# Altium schematic sheet B303AA.SchDoc: Manuel Shot Button
size A4; SheetNumber: 1; SheetTotal: 1
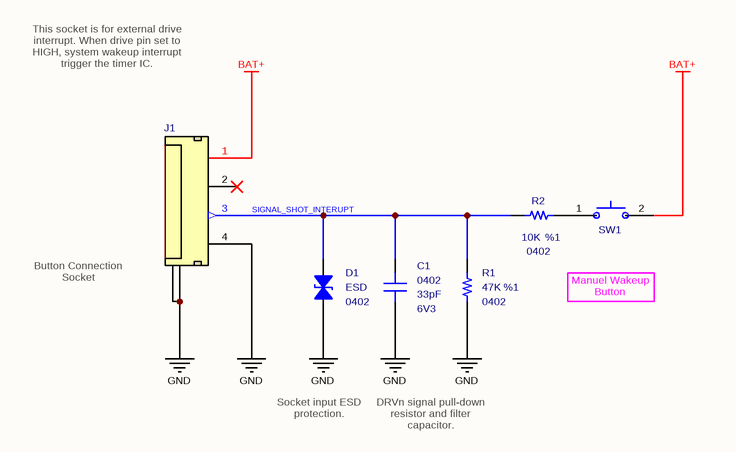
[diagram p0: B303AA.SchDoc]

## Parts
C1  value 33pF  Case: 0402  Voltage: 6V3  [CAPACITOR_0402]  (hidden comment: Multilayer Ceramic Capacitor)
D1  Case: 0402  [ESD_0402]  (hidden comment: ESD Suppressors)
J1  Shot Button Socket  [Connector_Tunic 4P - H]  (value not drawn)
R1  value 47K  Tolerance: %1  Case: 0402  [RESISTOR_0402]  (hidden comment: Thick Film Resistor)
R2  value 10K  Tolerance: %1  Case: 0402  [RESISTOR_0402]  (hidden comment: Thick Film Resistor)
SW1  Tactile Switches  [PTS526_Switch]  (value not drawn)

## Nets
BAT+: J1.1(BAT+) SW1.2(COM)
GND: C1.1 D1.1 J1.4(GND) J1.5(Termination) J1.6(Termination) R1.1
SIGNAL_SHOT_INTERUPT: C1.2 D1.2 J1.3(Button) R1.2 R2.2
NetR2_1: R2.1 SW1.1(NC)

Not connected (* = marked no-connect by the designer): J1 2(NC)*

## Notes on the sheet
- This socket is for external drive interrupt. When drive pin set to HIGH, system wakeup interrupt trigger the timer IC.
- (near J1) Button Connection
  Socket
- Manuel Wakeup Button
- Socket input ESD protection.
- DRVn signal pull-down resistor and filter capacitor.
- Title
- Size:
- Date:
- A4
- Number:
- Time:
- Revision:
- Sheet
- of
- File:
- (in symbol Diode - ESD Protection) ESD

## Library data of the parts
C1 = Capacitor - 33pF [0402-6V3]: Capacitor - 33pF [0402] (Ceramic); Manufacturer_Name: Kemet; Manufacturer_Part_Number: C0402C330J9RACAUTO; Dielectric: X7R; Tolerance: 10%; Height: 0.5mm; Mouser_Part_Number: 80-C0402C330J9RAUTO; Maximum Operating Temperature: +125; Minimum Operating Temperature: -55; ROHS: Yes; ComponentLink1Description: DataSheet; ComponentLink1URL: https://api.kemet.com/component-edge/download/datasheet/C0402C330J9RACAUTO.pdf; ComponentLink2Description: Mouser; ComponentLink2URL: https://www.mouser.com/Search/Refine.aspx?Keyword=80-C0402C330J9RAUTO; Supplier 1: Mouser; Supplier Part Number 1: 80-C0402C330J9RAUTO
D1 = Diode - ESD Protection: TVS Diode (Bi-directional); Manufacturer_Name: Bussmann / Eaton; Manufacturer_Part_Number: 0402ESDA-MLP1; Clamping Voltage: 35V; Diode Capacitance: 0.05pF; Polarity: Bidirectional; Voltage ESD Air Gap: 15kV; Voltage ESD Contact: 8kV; Working Voltage: 30V; Height: 0.436mm; Mouser_Part_Number: 504-0402ESDA-MLP1; Maximum Operating Temperature: +125; Minimum Operating Temperature: -55; ROHS: Yes; ComponentLink1Description: DataSheet; ComponentLink1URL: https://www.mouser.com.tr/datasheet/2/87/47c59e11-d058-4882-bc35-d8572f2ca054-38826.pdf; ComponentLink2Description: Mouser; ComponentLink2URL: https://www.mouser.com.tr/ProductDetail/Bussmann-Eaton/0402ESDA-MLP1?qs=%2Fha2pyFadughxyc7TyLWeW%2FUvipVY6Ex3naV%2FjpO3plZBZWDLqV4bw%3D%3D; Supplier 1: Mouser; Supplier 2: Digi-Key; Supplier Part Number 2: 283-2964-1-ND; Supplier Part Number 1: 504-0402ESDA-MLP1
J1 = Connector - Mini Tunic 4P (1.25): Mini Tunic Connector with 4P; Manufacturer_Part_Number: 53261-0471; Manufacturer_Name: Molex; Pitch: 1.25mm; Position: 4; ROHS: Yes; ComponentLink1Description: DataSheet; ComponentLink1URL: https://www.mouser.com.tr/datasheet/2/276/0532610471_PCB_HEADERS-170942.pdf; ComponentLink2Description: Mouser; ComponentLink2URL: https://www.mouser.com.tr/ProductDetail/Molex/53261-0471?qs=%2Fha2pyFaduhLhIsk8tywtK7BwWtguBSP4XxyDBTOTfs%3D; Case: SMD; Mouser_Part_Number: 538-53261-0471; Supplier 1: Mouser; Supplier 2: Digi-Key; Supplier Part Number 1: 538-53261-0471; Supplier Part Number 2: WM7622CT-ND; System: Connector
R1 = Resistor - 47K: Thick Film Resistors - SMD 1/16 W 47 Kohms 1%; Manufacturer_Name: Vishay; Manufacturer_Part_Number: CRCW040247K0FKED; Height: 0.4mm; Mouser_Part_Number: 71-CRCW0402-47K-E3; ComponentLink1Description: DataSheet; ComponentLink1URL: https://www.mouser.com.tr/datasheet/2/427/dcrcwe3-1762152.pdf; ComponentLink2Description: Mouser; ComponentLink2URL: https://www.mouser.com.tr/ProductDetail/Vishay-Dale/CRCW040247K0FKED?qs=sGAEpiMZZMu61qfTUdNhG2DpbjADlD3GL%252B3h1elTxqU%3D; Supplier 1: Mouser; Supplier 2: Digi-Key; Supplier Part Number 1: 71-CRCW040247K0FKEDH; Supplier Part Number 2: 541-47.0KYCT-ND
R2 = Resistor - 10K: Thick Film Resistors - SMD 1/16 W 10 Kohms 1%; Manufacturer_Name: Vishay; Manufacturer_Part_Number: CRCW040210K0FKED; Height: 0.4mm; Mouser_Part_Number: 71-CRCW0402-10K-E3; ComponentLink1Description: DataSheet; ComponentLink1URL: https://www.mouser.com.tr/datasheet/2/427/dcrcwe3-1762152.pdf; ComponentLink2Description: Mouser; ComponentLink2URL: https://www.mouser.com.tr/ProductDetail/Vishay-Dale/CRCW040210K0FKED?qs=sGAEpiMZZMu61qfTUdNhG2DpbjADlD3GcalbOv9utCY%3D; Supplier 1: Mouser; Supplier 2: Digi-Key; Supplier Part Number 1: 71-CRCW040210K0FKEDH; Supplier Part Number 2: 541-10.0KYCT-ND
SW1 = Switch - Tactile (SMD): Tactile Switches 50mA 12VDC, 5.2x5.2mm, 0.8mm H, 260gf, G leads.; Manufacturer_Name: C&K Switches; Manufacturer_Part_Number: PTS526 SK08 SMTR2 LFS; Height: 0.8mm; Mouser_Part_Number: 611-PTS526SK08SMTR2L; ComponentLink1Description: DataSheet; ComponentLink1URL: https://eu.mouser.com/datasheet/2/60/pts526-1651200.pdf; ComponentLink2Description: Mouser; ComponentLink2URL: https://eu.mouser.com/ProductDetail/CK/PTS526-SK08-SMTR2-LFS?qs=sGAEpiMZZMsgGjVA3toVBL%2FRce%252ByN3s1hQPqiLlQ%252BeM%3D; Supplier 1: Future Electronics; Supplier 2: Mouser; Supplier 3: Arrow; Supplier 4: Digi-Key; Supplier Part Number 1: PTS526SK08SMTR2LFS-REEL; Supplier Part Number 2: 611-PTS526SK08SMTR2L; Supplier Part Number 3: PTS526 SK08 SMTR2 LFS; Supplier Part Number 4: CKN12219-1-ND